# Altium project SimpleFOCDriver.PrjPCB
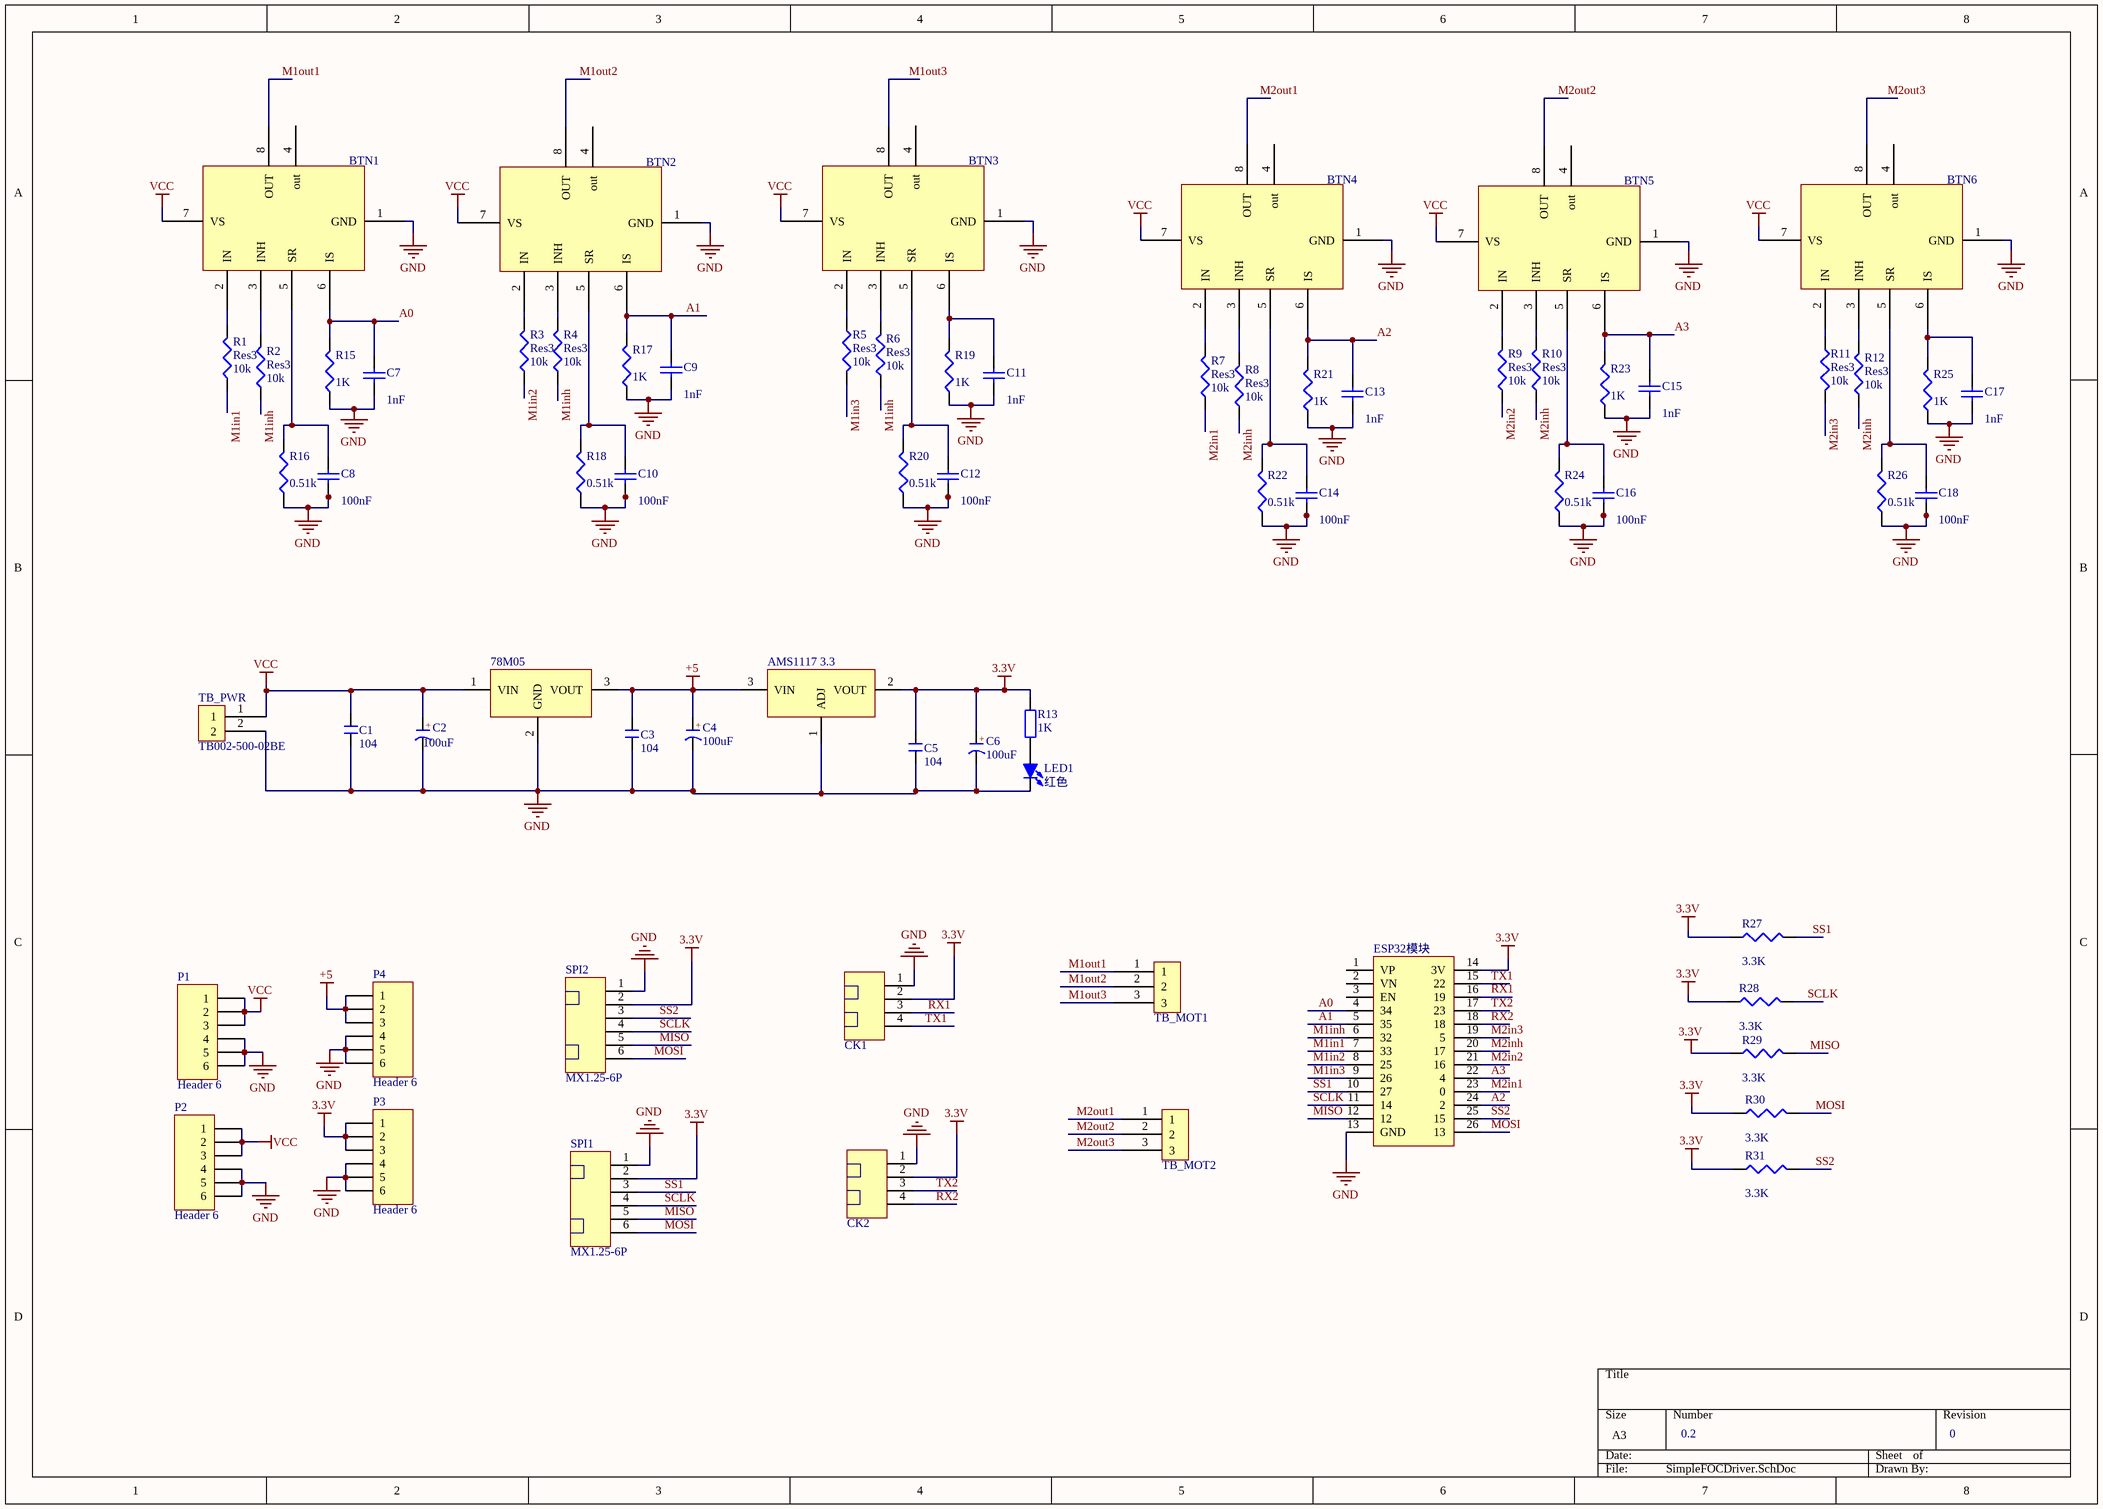
[diagram p0: SimpleFOCDriver.SchDoc]
1 sheet, 69 parts. Net scope: global (net labels, ports and power ports of the same name join across sheets).
Board file: PCB1.PcbDoc

## Sheet SimpleFOCDriver.SchDoc
size A3

### Parts
78M05  78M05  [TO252]  (value not drawn)
AMS1117_3.3  AMS1117 3.3  [SOT223]  (value not drawn)
BTN1  BTN8982  [BTN8982]  (value not drawn)
BTN2  BTN8982  [BTN8982]  (value not drawn)
BTN3  BTN8982  [BTN8982]  (value not drawn)
BTN4  BTN8982  [BTN8982]  (value not drawn)
BTN5  BTN8982  [BTN8982]  (value not drawn)
BTN6  BTN8982  [BTN8982]  (value not drawn)
C1  104  [R 0603_M]
C2  100uF  [CM D(6.3*7.7)]
C3  104  [C 0603_M]
C4  100uF  [C7343-D]
C5  104  [C 0603_M]
C6  100uF  [C7343-D]
C7  value 1nF  [C 0603_M]  (hidden comment: Cap Semi)
C8  value 100nF  [C 0603_M]  (hidden comment: Cap Semi)
C9  value 1nF  [C 0603_M]  (hidden comment: Cap Semi)
C10  value 100nF  [C 0603_M]  (hidden comment: Cap Semi)
C11  value 1nF  [C 0603_M]  (hidden comment: Cap Semi)
C12  value 100nF  [C 0603_M]  (hidden comment: Cap Semi)
C13  value 1nF  [C 0603_M]  (hidden comment: Cap Semi)
C14  value 100nF  [C 0603_M]  (hidden comment: Cap Semi)
C15  value 1nF  [C 0603_M]  (hidden comment: Cap Semi)
C16  value 100nF  [C 0603_M]  (hidden comment: Cap Semi)
C17  value 1nF  [C 0603_M]  (hidden comment: Cap Semi)
C18  value 100nF  [C 0603_M]  (hidden comment: Cap Semi)
CK1  MX1.25-4P  [MX1.25WS-4P]  (value not drawn)
CK2  MX1.25-4P  [MX1.25WS-4P]  (value not drawn)
ESP32模块  ESP32  [esp32]  (value not drawn)
LED1  红色  [LED 0603R]
P1  Header 6  [HDR1X6]
P2  Header 6  [HDR1X6]
P3  Header 6  [HDR1X6]
P4  Header 6  [HDR1X6]
R1  Res3  value 10k  [R 0603_M]
R2  Res3  value 10k  [R 0603_M]
R3  Res3  value 10k  [R 0603_M]
R4  Res3  value 10k  [R 0603_M]
R5  Res3  value 10k  [R 0603_M]
R6  Res3  value 10k  [R 0603_M]
R7  Res3  value 10k  [R 0603_M]
R8  Res3  value 10k  [R 0603_M]
R9  Res3  value 10k  [R 0603_M]
R10  Res3  value 10k  [R 0603_M]
R11  Res3  value 10k  [R 0603_M]
R12  Res3  value 10k  [R 0603_M]
R13  1K  [R 0603_M]
R15  value 1K  [R 0603_M]  (hidden comment: Res3)
R16  value 0.51k  [R 0603_M]  (hidden comment: Res3)
R17  value 1K  [R 0603_M]  (hidden comment: Res3)
R18  value 0.51k  [R 0603_M]  (hidden comment: Res3)
R19  value 1K  [R 0603_M]  (hidden comment: Res3)
R20  value 0.51k  [R 0603_M]  (hidden comment: Res3)
R21  value 1K  [R 0603_M]  (hidden comment: Res3)
R22  value 0.51k  [R 0603_M]  (hidden comment: Res3)
R23  value 1K  [R 0603_M]  (hidden comment: Res3)
R24  value 0.51k  [R 0603_M]  (hidden comment: Res3)
R25  value 1K  [R 0603_M]  (hidden comment: Res3)
R26  value 0.51k  [R 0603_M]  (hidden comment: Res3)
R27  value 3.3K  [R 0603_M]  (hidden comment: Res3)
R28  value 3.3K  [R 0603_M]  (hidden comment: Res3)
R29  value 3.3K  [R 0603_M]  (hidden comment: Res3)
R30  value 3.3K  [R 0603_M]  (hidden comment: Res3)
R31  value 3.3K  [R 0603_M]  (hidden comment: Res3)
SPI1  MX1.25-6P  [MX1.25WS-6P]
SPI2  MX1.25-6P  [MX1.25WS-6P]
TB_MOT1  TB002-500-03BE  [mr30pw-mz]  (value not drawn)
TB_MOT2  TB002-500-03BE  [mr30pw-mz]  (value not drawn)
TB_PWR  TB002-500-02BE  [pin2 mr30pw-mz]

### Nets
3.3V: AMS1117_3.3.2(VOUT) C5.2 C6.1(A) CK1.2 CK2.2 ESP32模块.14(3V) P3.1 P3.2 P3.3 R13.2 R27.1 R28.1 R29.1 R30.1 R31.1 SPI1.2 SPI2.2
+5: 78M05.3(VOUT) AMS1117_3.3.3(VIN) C3.2 C4.1(A) P4.1 P4.2 P4.3
GND: 78M05.2(GND) AMS1117_3.3.1(ADJ) BTN1.1(GND) BTN2.1(GND) BTN3.1(GND) BTN4.1(GND) BTN5.1(GND) BTN6.1(GND) C1.1 C2.2(K) C3.1 C4.2(K) C5.1 C6.2(K) C7.1 C8.1 C9.1 C10.1 C11.1 C12.1 C13.1 C14.1 C15.1 C16.1 C17.1 C18.1 CK1.1 CK2.1 ESP32模块.13(GND) LED1.2(K) P1.4 P1.5 P1.6 P2.4 P2.5 P2.6 P3.4 P3.5 P3.6 P4.4 P4.5 P4.6 R15.1 R16.1 R17.1 R18.1 R19.1 R20.1 R21.1 R22.1 R23.1 R24.1 R25.1 R26.1 SPI1.1 SPI2.1 TB_PWR.2
VCC: 78M05.1(VIN) BTN1.7(VS) BTN2.7(VS) BTN3.7(VS) BTN4.7(VS) BTN5.7(VS) BTN6.7(VS) C1.2 C2.1(A) P1.1 P1.2 P1.3 P2.1 P2.2 P2.3 TB_PWR.1
A0: BTN1.6(IS) C7.2 ESP32模块.4(34) R15.2
A1: BTN2.6(IS) C9.2 ESP32模块.5(35) R17.2
A2: BTN4.6(IS) C13.2 ESP32模块.24(2) R21.2
A3: BTN5.6(IS) C15.2 ESP32模块.22(4) R23.2
M1in1: ESP32模块.7(33) R1.1
M1in2: ESP32模块.8(25) R3.1
M1in3: ESP32模块.9(26) R5.2
M1inh: ESP32模块.6(32) R2.1 R4.1 R6.1
M1out1: BTN1.8(OUT) TB_MOT1.1
M1out2: BTN2.8(OUT) TB_MOT1.2
M1out3: BTN3.8(OUT) TB_MOT1.3
M2in1: ESP32模块.23(0) R7.1
M2in2: ESP32模块.21(16) R9.1
M2in3: ESP32模块.19(5) R11.2
M2inh: ESP32模块.20(17) R8.1 R10.1 R12.1
M2out1: BTN4.8(OUT) TB_MOT2.1
M2out2: BTN5.8(OUT) TB_MOT2.2
M2out3: BTN6.8(OUT) TB_MOT2.3
MISO: ESP32模块.12 R29.2 SPI1.5 SPI2.5
MOSI: ESP32模块.26(13) R30.2 SPI1.6 SPI2.6
RX1: CK1.3 ESP32模块.16(19)
RX2: CK2.4 ESP32模块.18
SCLK: ESP32模块.11(14) R28.2 SPI1.4 SPI2.4
SS1: ESP32模块.10(27) R27.2 SPI1.3
SS2: ESP32模块.25(15) R31.2 SPI2.3
TX1: CK1.4 ESP32模块.15(22)
TX2: CK2.3 ESP32模块.17(23)
NetBTN1_2: BTN1.2(IN) R1.2
NetBTN1_3: BTN1.3(INH) R2.2
NetBTN1_5: BTN1.5(SR) C8.2 R16.2
NetBTN2_2: BTN2.2(IN) R3.2
NetBTN2_3: BTN2.3(INH) R4.2
NetBTN2_5: BTN2.5(SR) C10.2 R18.2
NetBTN3_2: BTN3.2(IN) R5.1
NetBTN3_3: BTN3.3(INH) R6.2
NetBTN3_5: BTN3.5(SR) C12.2 R20.2
NetBTN3_6: BTN3.6(IS) C11.2 R19.2
NetBTN4_2: BTN4.2(IN) R7.2
NetBTN4_3: BTN4.3(INH) R8.2
NetBTN4_5: BTN4.5(SR) C14.2 R22.2
NetBTN5_2: BTN5.2(IN) R9.2
NetBTN5_3: BTN5.3(INH) R10.2
NetBTN5_5: BTN5.5(SR) C16.2 R24.2
NetBTN6_2: BTN6.2(IN) R11.1
NetBTN6_3: BTN6.3(INH) R12.2
NetBTN6_5: BTN6.5(SR) C18.2 R26.2
NetBTN6_6: BTN6.6(IS) C17.2 R25.2
NetLED1_1: LED1.1(A) R13.1

Not connected (* = marked no-connect by the designer): BTN1 4(out); BTN2 4(out); BTN3 4(out); BTN4 4(out); BTN5 4(out); BTN6 4(out); ESP32模块 1(VP) 2(VN) 3(EN)

### Notes on the sheet
- 0.2
- 0
- (in symbol C-CD) +
- (in symbol C-CT) +

### Library data of the parts
78M05 = 78Mxx: 线性稳压芯片; 版权归属: 源创客; BOM名称: 线性稳压芯片; 学习资源: www.ooocke.com
AMS1117_3.3 = LM317: 可调线性稳压芯片; 版权归属: 源创客; BOM名称: 可调线性稳压芯片; 学习资源: www.ooocke.com
C1 C3 C5 = C: 无极性贴片电容; 版权归属: 源创客; 材质: X7R; BOM名称: 无极性贴片电容; 学习资源: www.ooocke.com
C2 = C-CT: 贴片固态电容; 版权归属: 源创客; BOM名称: 贴片固态电容; 学习资源: www.ooocke.com
C4 C6 = C-CD: 贴片钽电容; 版权归属: 源创客; BOM名称: 贴片钽电容; 学习资源: www.ooocke.com
C7-C18 = Cap Semi: Capacitor (Semiconductor SIM Model); Published: 8-Jun-2000; LatestRevisionDate: 29-May-2009; LatestRevisionNote: IPC-7351 Footprint Added.; Publisher: Altium Limited; PackageDescription: Chip Capacitor
  C7 C9 C11 C13 C15 C17: PackageReference: C0603
  C8 C10 C12 C14 C16 C18: PackageReference: C1206
LED1 = LED-F234: 方形LED; 版权归属: 源创客; BOM名称: 方形LED; 学习资源: www.ooocke.com
P1-P4 = Header 6: Header, 6-Pin; LatestRevisionDate: 17-Jul-2002; LatestRevisionNote: Re-released for DXP Platform.; Publisher: Altium Limited
R1-R12 R15-R31 = Res3: Resistor; Published: 8-Jun-2000; LatestRevisionDate: 29-May-2009; LatestRevisionNote: IPC-7351 Footprint Added.; PackageReference: J1-0603; Publisher: Altium Limited; PackageDescription: Chip Resistor
R13 = R: 贴片电阻; 版权归属: 源创客; BOM名称: 贴片电阻; 学习资源: www.ooocke.com
BTN1-BTN6 = BTN8982: Supplier 1: RSComponents
TB_MOT1 TB_MOT2 = TB002-500-03BE: Supplier 1: Mouser; Supplier Part Number 1: 490-TB002-500-03BE
TB_PWR = TB002-500-02BE: Supplier 1: Mouser; Supplier Part Number 1: 490-TB002-500-02BE